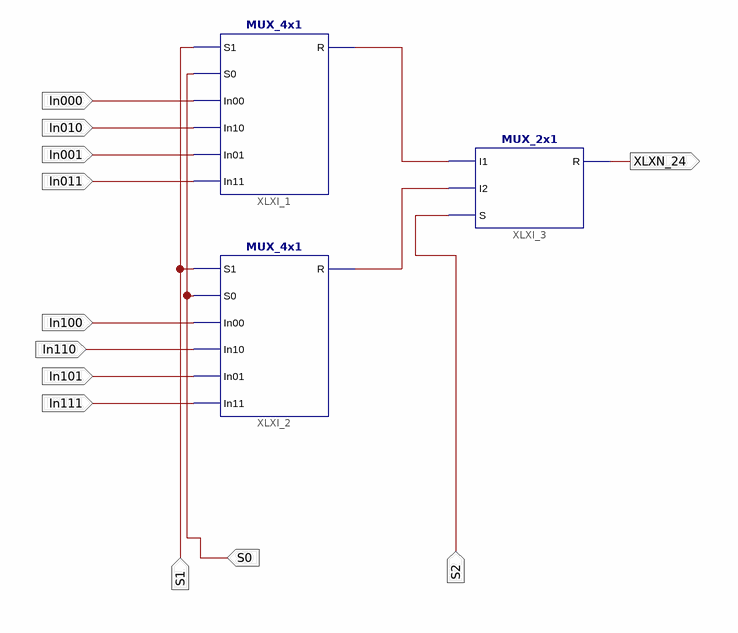
[diagram p0: schematic sheet 1]
// Xilinx ISE schematic MUX_8x1.sch (spartan3) as structural Verilog: 3 symbols, 12 ports
module MUX_8x1 (
  input  In000,
  input  In010,
  input  In001,
  input  In011,
  input  In100,
  input  In110,
  input  In101,
  input  In111,
  input  S0,
  input  S1,
  input  S2,
  output XLXN_24
);

  wire XLXN_22, XLXN_23;

  MUX_4x1 XLXI_1 (.S1(S1), .S0(S0), .In00(In000), .In10(In010), .In01(In001), .In11(In011), .R(XLXN_22));
  MUX_4x1 XLXI_2 (.S1(S1), .S0(S0), .In00(In100), .In10(In110), .In01(In101), .In11(In111), .R(XLXN_23));
  MUX_2x1 XLXI_3 (.I1(XLXN_22), .I2(XLXN_23), .S(S2), .R(XLXN_24));
endmodule
